# Altium schematic sheet Sheet1.SchDoc
size A4; SheetNumber: 1; SheetTotal: 1
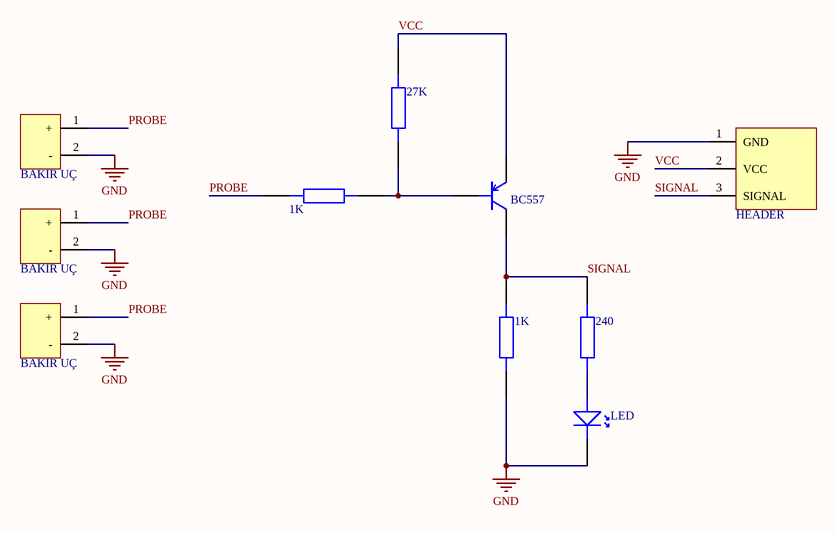
[diagram p0: Sheet1.SchDoc]

## Parts
D1  LED  [LED]
K1  BAKIR UÇ  [KONNECTOR 2 PIN]
K2  BAKIR UÇ  [KONNECTOR 2 PIN]
K3  BAKIR UÇ  [KONNECTOR 2 PIN]
K4  HEADER  [KONNECTOR 3 PIN]
R1  1K  [RESISTOR]
R2  27K  [RESISTOR]
R3  1K  [RESISTOR]
R4  240  [RESISTOR]
T1  BC557  [TRANSİSTOR]

## Nets
GND: D1.2 K1.2(-) K2.2(-) K3.2(-) K4.1(GND) R3.1
PROBE: K1.1(+) K2.1(+) K3.1(+) R1.1
SIGNAL: K4.3(SIGNAL) R3.2 R4.2 T1.2
VCC: K4.2(VCC) R2.2 T1.3
NetD1_1: D1.1 R4.1
NetR1_2: R1.2 R2.1 T1.1

## Library data of the parts
K1-K3 = HEADER 2 PIN
K4 = HEADER 3 PIN
R1-R4 = RESISTOR
T1 = TRANSISTOR